# Altium project COMECA.PrjPcb
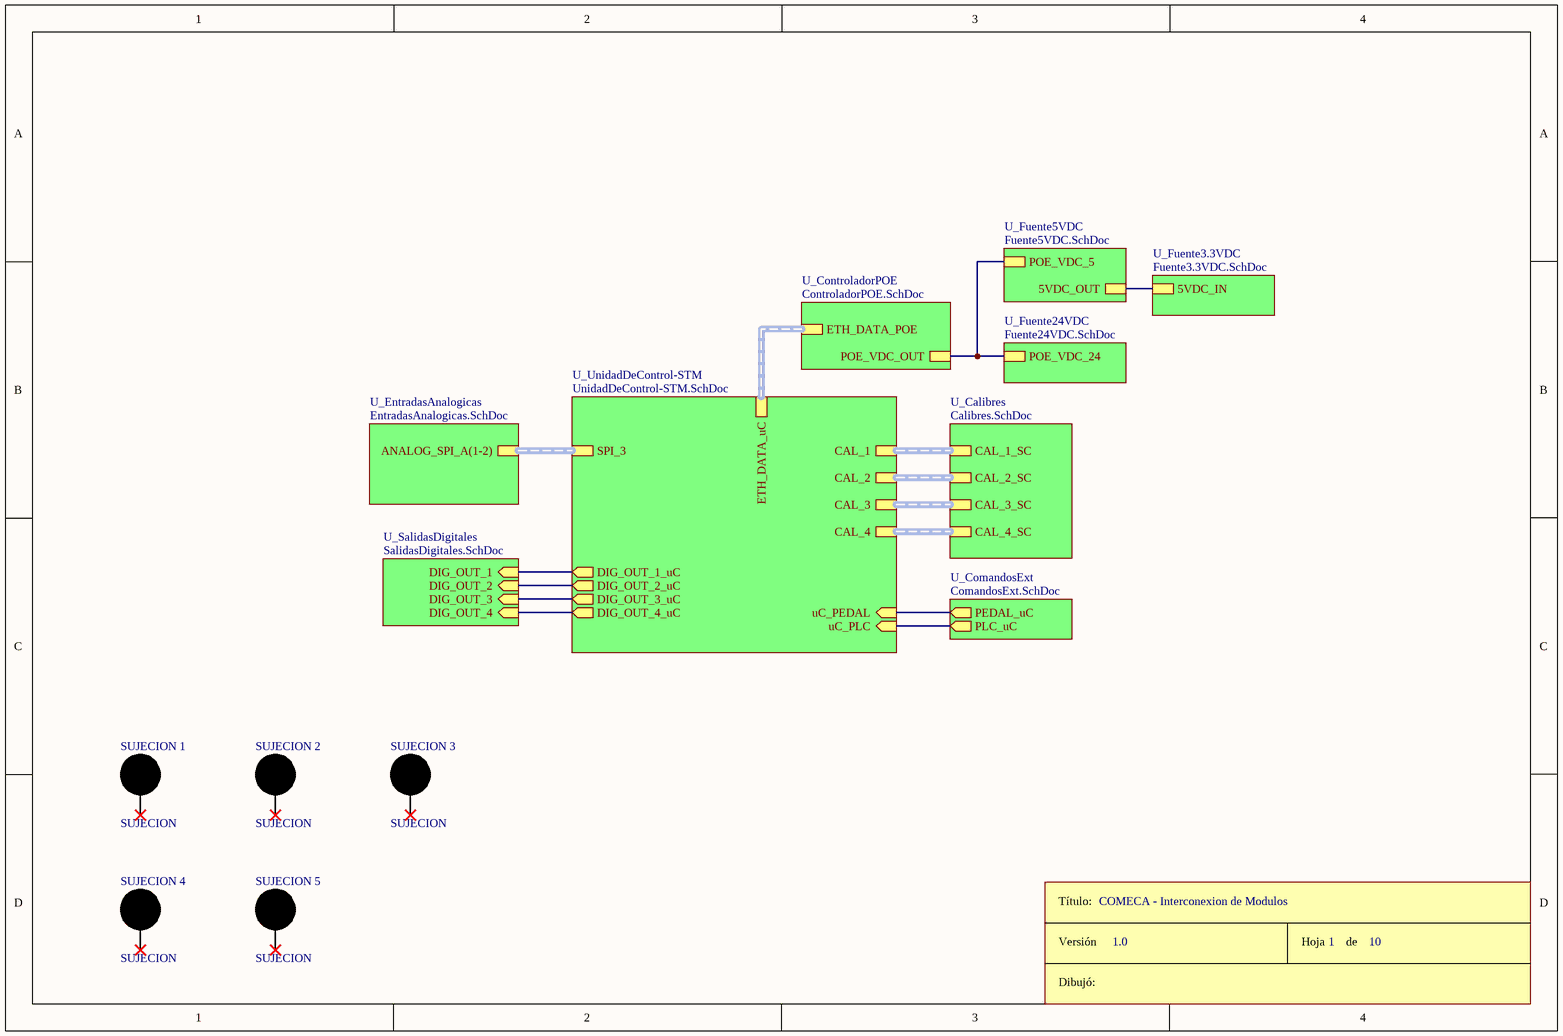
[diagram p0: COMECA_Main.SchDoc]
8 sheets, 88 parts. Net scope: hierarchical (ports join the sheet entries above them; power ports are global).
Board file: COMECA-PCBv1.PcbDoc
Sheets:
  COMECA_Main.SchDoc
    U_ControladorPOE = ControladorPOE.SchDoc
    U_Fuente5VDC = Fuente5VDC.SchDoc
    U_Fuente24VDC = Fuente24VDC.SchDoc
    U_Fuente3.3VDC = Fuente3.3VDC.SchDoc
    U_ComandosExt = ComandosExt.SchDoc
    U_EntradasAnalogicas = EntradasAnalogicas.SchDoc
    U_UnidadDeControl-STM = UnidadDeControl-STM.SchDoc

## Sheet COMECA_Main.SchDoc
size A4; SheetNumber: 1; SheetTotal: 10

### Parts
ROT9  Rótulo  (value not drawn)  (graphical)
SUJECION_1  SUJECION  [SUJECION (5.00MM - 3.50MM)]
SUJECION_2  SUJECION  [SUJECION (5.00MM - 3.50MM)]
SUJECION_3  SUJECION  [SUJECION (5.00MM - 3.50MM)]
SUJECION_4  SUJECION  [SUJECION (5.00MM - 3.50MM)]
SUJECION_5  SUJECION  [SUJECION (5.00MM - 3.50MM)]

### Sub-sheets
U_Calibres = Calibres.SchDoc (file not in this document): CAL_4_SC (harness CALIBRE), CAL_3_SC (harness CALIBRE), CAL_2_SC (harness CALIBRE), CAL_1_SC (harness CALIBRE)
U_ComandosExt = ComandosExt.SchDoc: PLC_uC (out), PEDAL_uC (out)
U_ControladorPOE = ControladorPOE.SchDoc: POE_VDC_OUT, ETH_DATA_POE (harness ETH_DATA)
U_EntradasAnalogicas = EntradasAnalogicas.SchDoc: ANALOG_SPI_A(1-2) (harness ANALOG_SPI)
U_Fuente3.3VDC = Fuente3.3VDC.SchDoc: 5VDC_IN
U_Fuente5VDC = Fuente5VDC.SchDoc: POE_VDC_5, 5VDC_OUT
U_Fuente24VDC = Fuente24VDC.SchDoc: POE_VDC_24
U_SalidasDigitales = SalidasDigitales.SchDoc (file not in this document): DIG_OUT_4 (in), DIG_OUT_2 (in), DIG_OUT_3 (in), DIG_OUT_1 (in)
U_UnidadDeControl-STM = UnidadDeControl-STM.SchDoc: uC_PLC (in), uC_PEDAL (in), SPI_3 (harness ANALOG_SPI), CAL_2 (harness CALIBRE), CAL_3 (harness CALIBRE), CAL_4 (harness CALIBRE), CAL_1 (harness CALIBRE), DIG_OUT_3_uC (out), DIG_OUT_2_uC (out), DIG_OUT_1_uC (out), DIG_OUT_4_uC (out), ETH_DATA_uC (harness ETH_DATA)

### Nets
PB6: sheet U_ComandosExt/PLC_uC, sheet U_UnidadDeControl-STM/uC_PLC
PB8: sheet U_ComandosExt/PEDAL_uC, sheet U_UnidadDeControl-STM/uC_PEDAL
PC7: sheet U_UnidadDeControl-STM/DIG_OUT_2_uC, sheet U_SalidasDigitales/DIG_OUT_2
PC9: sheet U_UnidadDeControl-STM/DIG_OUT_1_uC, sheet U_SalidasDigitales/DIG_OUT_1
PD13: sheet U_UnidadDeControl-STM/DIG_OUT_4_uC, sheet U_SalidasDigitales/DIG_OUT_4
PD15: sheet U_UnidadDeControl-STM/DIG_OUT_3_uC, sheet U_SalidasDigitales/DIG_OUT_3
NetC1_1: sheet U_ControladorPOE/POE_VDC_OUT, sheet U_Fuente5VDC/POE_VDC_5, sheet U_Fuente24VDC/POE_VDC_24
NetC3_1: sheet U_Fuente5VDC/5VDC_OUT, sheet U_Fuente3.3VDC/5VDC_IN

Not connected (* = marked no-connect by the designer): SUJECION_1 1*; SUJECION_2 1*; SUJECION_3 1*; SUJECION_4 1*; SUJECION_5 1*

### Buses and harness runs
harness sheet U_Calibres/CAL_1_SC = sheet U_UnidadDeControl-STM/CAL_1
harness sheet U_Calibres/CAL_2_SC = sheet U_UnidadDeControl-STM/CAL_2
harness sheet U_Calibres/CAL_3_SC = sheet U_UnidadDeControl-STM/CAL_3
harness sheet U_Calibres/CAL_4_SC = sheet U_UnidadDeControl-STM/CAL_4
harness sheet U_ControladorPOE/ETH_DATA_POE = sheet U_UnidadDeControl-STM/ETH_DATA_uC
harness sheet U_EntradasAnalogicas/ANALOG_SPI_A(1-2) = sheet U_UnidadDeControl-STM/SPI_3

### Notes on the sheet
- COMECA - Interconexion de Modulos
- 1.0
- 1
- 10
- (in symbol Rótulo) Título:; Versión; Hoja       de; Dibujó:

## Sheet ControladorPOE.SchDoc
size A4; SheetNumber: 8; SheetTotal: 10
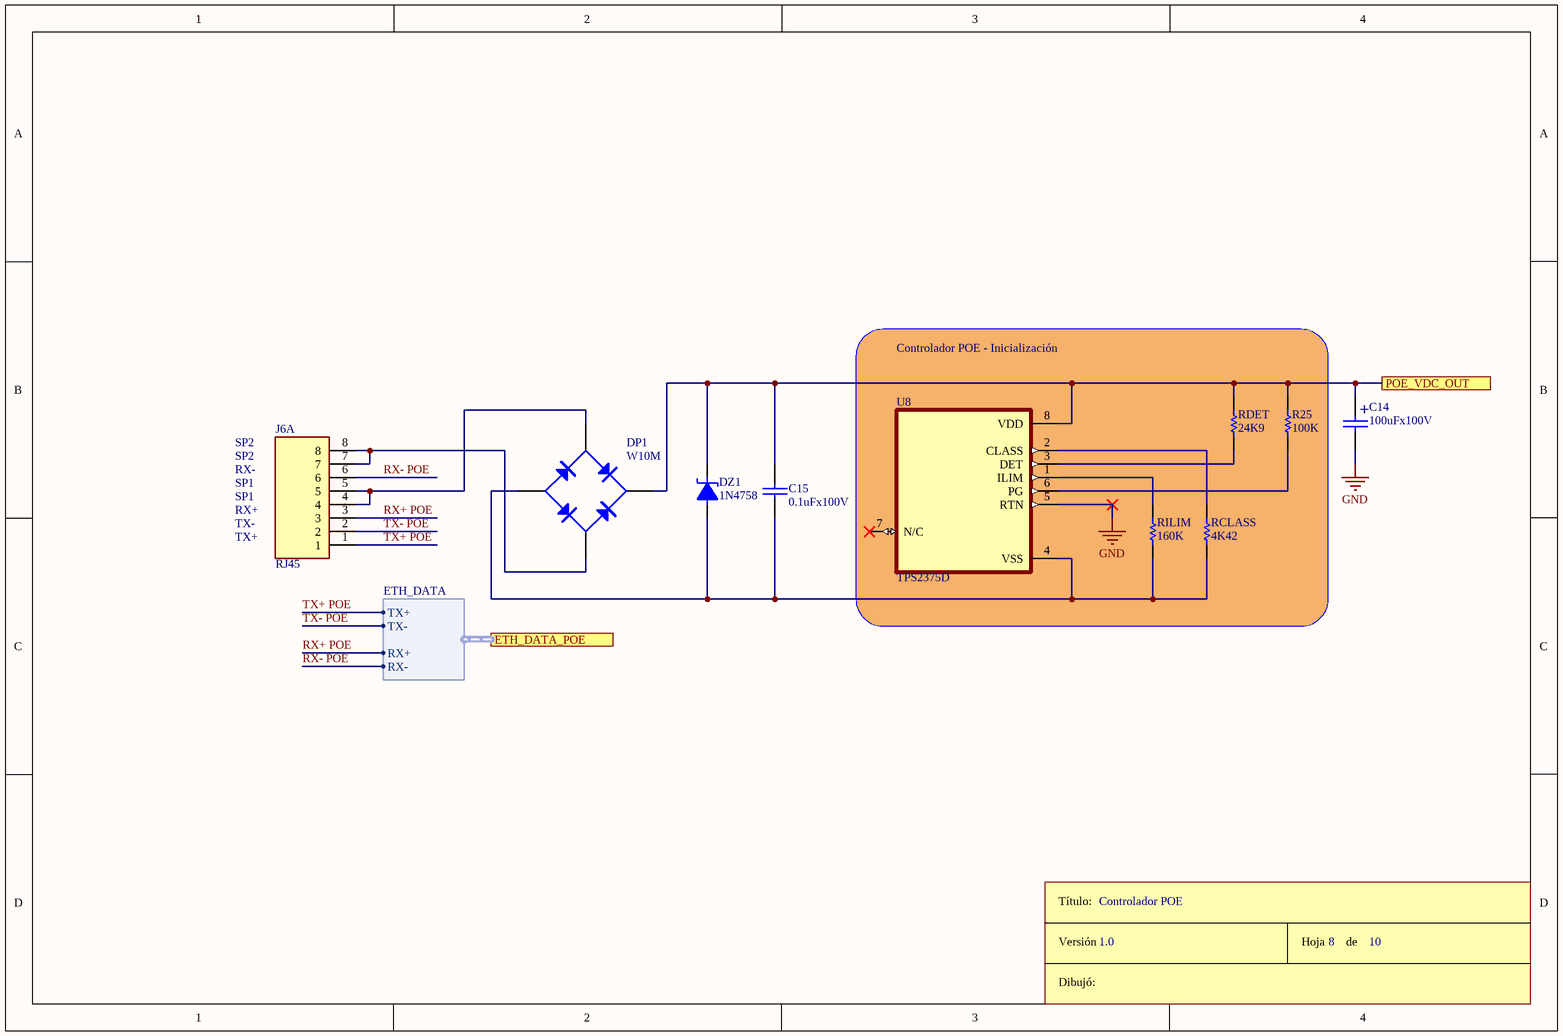
[diagram p1: ControladorPOE.SchDoc]

### Parts
C14  100uFx100V  [CAP200RP]
C15  0.1uFx100V  [CAP300]
DP1  W10M  [PUENTE - W10M]
DZ1  1N4758  [DO41]
J6A  RJ45  [CUI_CRJ032-1-TH]
R25  100K  [RES300]
RCLASS  4K42  [RES300]
RDET  24K9  [RES300]
RILIM  160K  [RES300]
ROT7  Rótulo  (value not drawn)  (graphical)
U8  TPS2375D  [SOIC127P599X175-8N]

### Blocks framed on the sheet
Controlador POE - Inicialización: R25 RCLASS RDET RILIM U8

### Ports
ETH_DATA_POE (harness ETH_DATA), POE_VDC_OUT

### Harnesses
ETH_DATA: TX+, TX-, RX+, RX-

### Nets
GND: C14.2 U8.5(RTN)
RX+ POE: J6A.3 ; port ETH_DATA_POE.RX+
RX- POE: J6A.6 ; port ETH_DATA_POE.RX-
TX+ POE: J6A.1 ; port ETH_DATA_POE.TX+
TX- POE: J6A.2 ; port ETH_DATA_POE.TX-
NetC1_1: C14.1 C15.1 DP1.1(V+) DZ1.2 R25.2 RDET.2 U8.8(VDD) ; port POE_VDC_OUT
NetC15_2: C15.2 DP1.3(V-) DZ1.1 RCLASS.1 RILIM.1 U8.4(VSS)
NetDP1_2: DP1.2(AC) J6A.4 J6A.5
NetDP1_4: DP1.4(AC) J6A.7 J6A.8
NetR25_1: R25.1 U8.6(PG)
NetRCLASS_2: RCLASS.2 U8.2(CLASS)
NetRDET_1: RDET.1 U8.3(DET)
NetRILIM_2: RILIM.2 U8.1(ILIM)

Not connected (* = marked no-connect by the designer): U8 7(N/C)*

### Notes on the sheet
- SP2
- RX+
- RX-
- SP1
- TX+
- TX-
- Controlador POE
- 1.0
- 8
- 10
- (in symbol CAPPOL) +
- (in symbol Rótulo) Título:; Versión; Hoja       de; Dibujó:

### Library data of the parts
C14 = CAPPOL
C15 = CAP
DP1 = PUENTE
DZ1 = DIODO ZENER
J6A = CRJ032-1-TH: 8P8C, Single Port, Horizontal, Unshielded, No LED, Through Hole, RJ45 Modular Connector; MF: CUI Devices; MP: CRJ032-1-TH; SnapEDA_Link: https://www.snapeda.com/parts/CRJ032-1-TH/CUI%20Devices/view-part/6363031/?ref=snap; Availability: In Stock; CUI_purchase_URL: https://www.cuidevices.com/product/interconnect/connectors/modular-connectors/rj45-connectors/crj032-1-th?utm_source=snapeda.com&utm_medium=referral&utm_campaign=snapedaBOM; Check_prices: https://www.snapeda.com/parts/CRJ032-1-TH/CUI%20Devices/view-part/6363031/?ref=eda; Value: *; Purchase-URL: https://pricing.snapeda.com/search/part/CRJ032-1-TH/?ref=eda; Package: None; Price: None
R25 RCLASS RDET RILIM = RES
U8 = TPS2375D: Class 3 PoE PD with latch protection 8-SOIC -40 to 85; MF: Texas Instruments; Purchase-URL: https://pricing.snapeda.com/search/part/TPS2375D/?ref=eda; MP: TPS2375D; Package: SOIC-8 Texas Instruments; SnapEDA_Link: https://www.snapeda.com/parts/TPS2375D/Texas%20Instruments/view-part/570877/?ref=snap; Value: *; Check_prices: https://www.snapeda.com/parts/TPS2375D/Texas%20Instruments/view-part/570877/?ref=eda; Digi-Key_Part_Number: 296-26922-2-ND

## Sheet Fuente5VDC.SchDoc
size A4; SheetNumber: 3; SheetTotal: 10
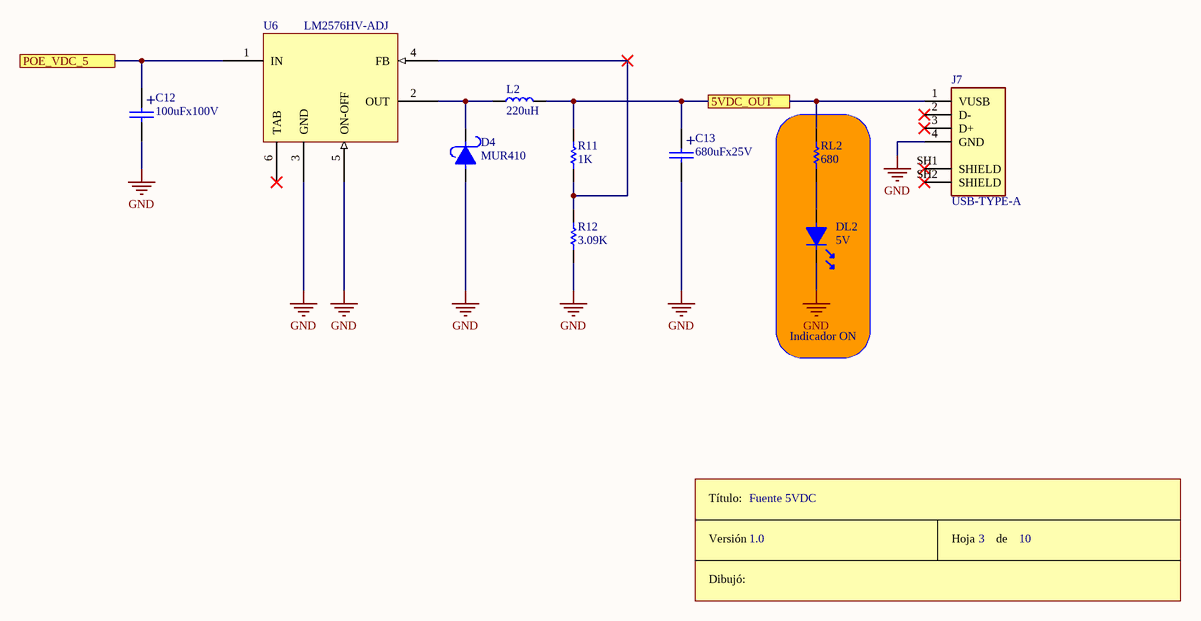
[diagram p2: Fuente5VDC.SchDoc]

### Parts
C12  100uFx100V  [CAP200RP]
C13  680uFx25V  [CAP200RP]
D4  MUR410  [DO41]
DL2  5V  [LED3]
J7  USB-TYPE-A  [TE_6364372-2]
L2  220uH  [CHOKE_PAD]
R11  1K  [RES300]
R12  3.09K  [RES300]
RL2  680  [RES300]
ROT5  Rótulo  (value not drawn)  (graphical)
U6  LM2576HV-ADJ  [TO-220_5 H]

### Blocks framed on the sheet
Indicador ON: DL2 RL2

### Ports
5VDC_OUT, POE_VDC_5

### Nets
GND: C12.2 C13.2 D4.1 DL2.2 J7.4(GND) R12.1 U6.3(GND) U6.5(ON-OFF)
NetC1_1: C12.1 U6.1(IN) ; port POE_VDC_5
NetC3_1: C13.1 J7.1(VUSB) L2.2 R11.2 RL2.2 ; port 5VDC_OUT
NetD4_2: D4.2 L2.1 U6.2(OUT)
NetDL2_1: DL2.1 RL2.1
NetR11_1: R11.1 R12.2 U6.4(FB)

Not connected (* = marked no-connect by the designer): J7 2(D-)* 3(D+)* SH1(SHIELD)* SH2(SHIELD)*; U6 6(TAB)*

### Notes on the sheet
- Fuente 5VDC
- 1.0
- 3
- 10
- (in symbol CAPPOL) +
- (in symbol Rótulo) Título:; Versión; Hoja       de; Dibujó:

### Library data of the parts
C12 C13 = CAPPOL
D4 = DIODO SCHOTTKY
DL2 = LED
J7 = 6364372-2: Conn USB 2.0 Type A RCP 4 POS Solder RA Thru-Hole 4 Terminal 1 Port Box/Tube; MF: TE Connectivity; Digi-Key_Purchase_URL: https://www.digikey.com/product-detail/en/te-connectivity-amp-connectors/6364372-2/A122647-ND/2286712?utm_source=snapeda&utm_medium=aggregator&utm_campaign=symbol; SnapEDA_Link: https://www.snapeda.com/parts/6364372-2/TE%20Connectivity%20AMP%20Connectors/view-part/2053020/?ref=snap; EU_RoHS_Compliance: Compliant; MP: 6364372-2; Value: *; TE_purchase_URL: https://www.te.com/usa-en/product-6364372-2.html?te_bu=Cor&te_type=disp&te_campaign=seda_glo_cor-seda-global-disp-prtnr-fy19-seda-model-bom-cta_sma-317_1&elqCampaignId=32493; Digi-Key_Part_Number: A122647-ND; Package: None
L2 = Choke
R11 R12 RL2 = RES
U6 = LM2575

## Sheet Fuente24VDC.SchDoc
size A4; SheetNumber: 2; SheetTotal: 10
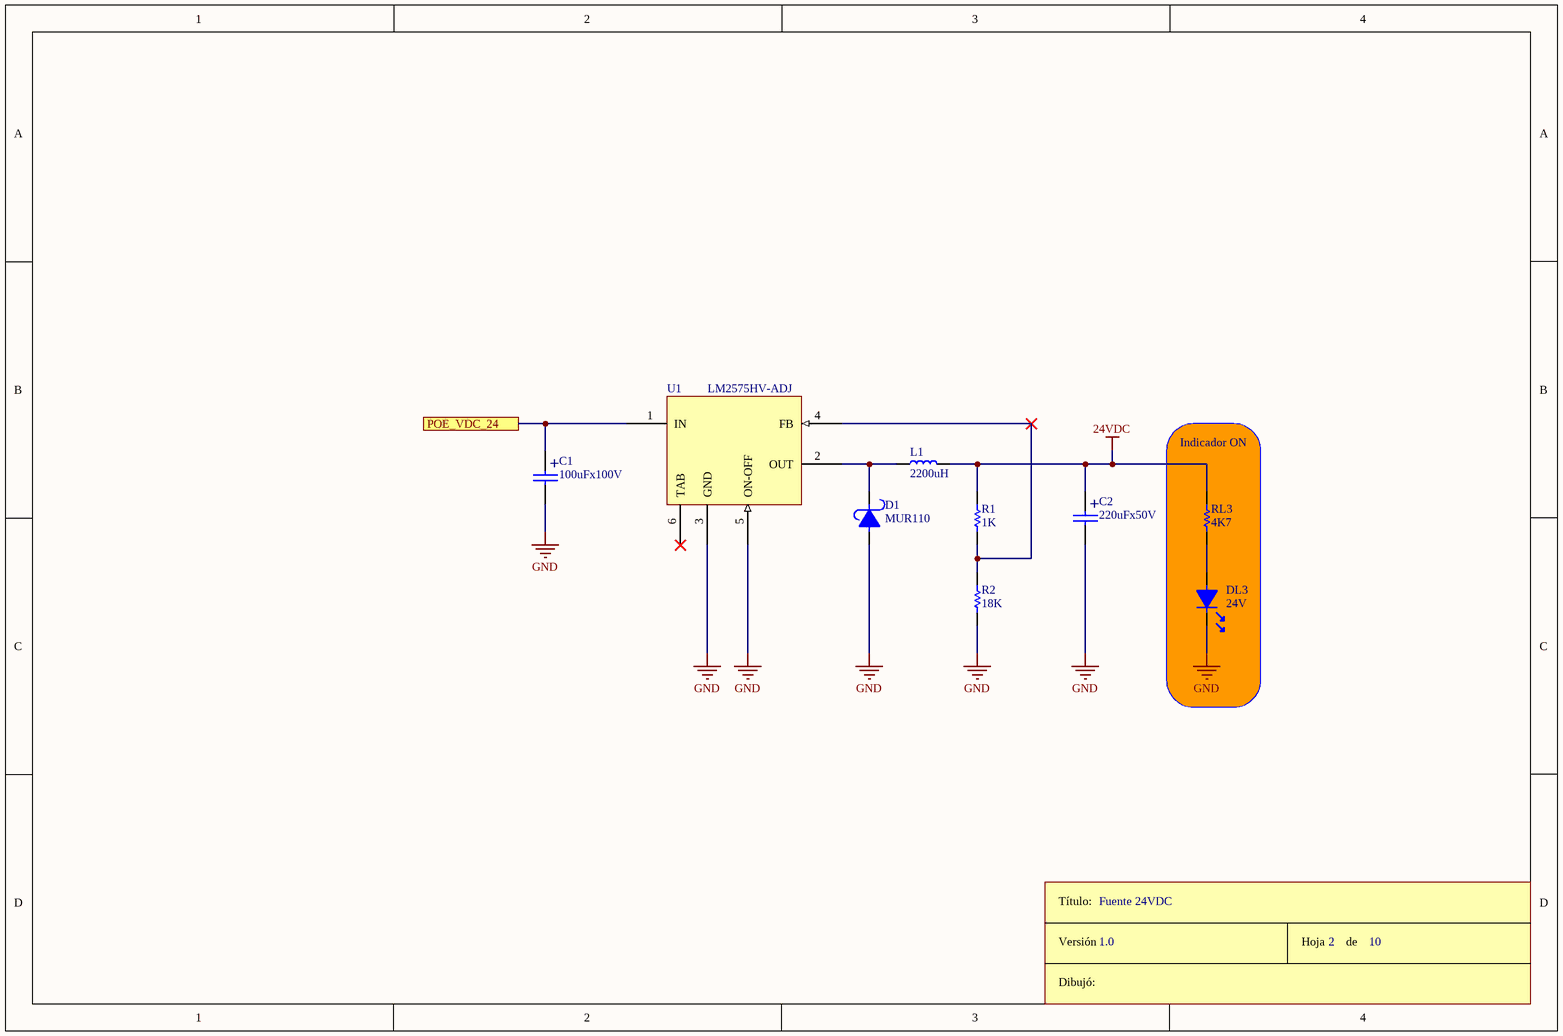
[diagram p3: Fuente24VDC.SchDoc]

### Parts
C1  100uFx100V  [CAP200RP]
C2  220uFx50V  [CAP200RP]
D1  MUR110  [DO41]
DL3  24V  [LED3]
L1  2200uH  [Choke10.5]
R1  1K  [RES300]
R2  18K  [RES300]
RL3  4K7  [RES300]
ROT1  Rótulo  (value not drawn)  (graphical)
U1  LM2575HV-ADJ  [TO-220_5 H]

### Blocks framed on the sheet
Indicador ON: DL3 RL3

### Ports
POE_VDC_24

### Nets
24VDC: C2.1 L1.2 R1.2 RL3.2
GND: C1.2 C2.2 D1.1 DL3.2 R2.1 U1.3(GND) U1.5(ON-OFF)
NetC1_1: C1.1 U1.1(IN) ; port POE_VDC_24
NetD1_2: D1.2 L1.1 U1.2(OUT)
NetDL3_1: DL3.1 RL3.1
NetR1_1: R1.1 R2.2 U1.4(FB)

Not connected (* = marked no-connect by the designer): U1 6(TAB)*

### Notes on the sheet
- Fuente 24VDC
- 1.0
- 2
- 10
- (in symbol CAPPOL) +
- (in symbol Rótulo) Título:; Versión; Hoja       de; Dibujó:

### Library data of the parts
C1 C2 = CAPPOL
D1 = DIODO SCHOTTKY
DL3 = LED
L1 = Choke
R1 R2 RL3 = RES
U1 = LM2575

## Sheet Fuente3.3VDC.SchDoc
size A4; SheetNumber: 4; SheetTotal: 10
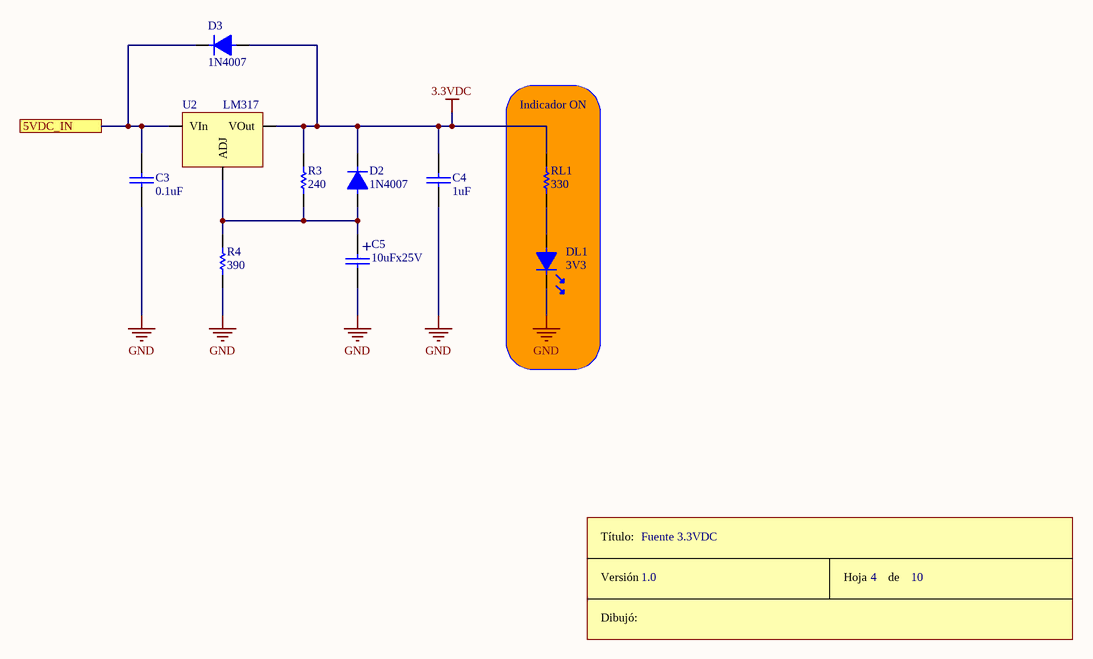
[diagram p4: Fuente3.3VDC.SchDoc]

### Parts
C3  0.1uF  [CAP100]
C4  1uF  [CAP200]
C5  10uFx25V  [CAP100RP]
D2  1N4007  [DO41]
D3  1N4007  [DO41]
DL1  3V3  [LED3]
R3  240  [RES400]
R4  390  [RES400]
RL1  330  [RES300]
ROT2  Rótulo  (value not drawn)  (graphical)
U2  LM317  [TO-220 H]

### Blocks framed on the sheet
Indicador ON: DL1 RL1

### Ports
5VDC_IN

### Nets
3.3VDC: C4.1 D2.2 D3.1 R3.2 RL1.2 U2.2(VOut)
GND: C3.2 C4.2 C5.2 DL1.2 R4.1
NetC3_1: C3.1 D3.2 U2.3(VIn) ; port 5VDC_IN
NetC5_1: C5.1 D2.1 R3.1 R4.2 U2.1(ADJ)
NetDL1_1: DL1.1 RL1.1

### Notes on the sheet
- Fuente 3.3VDC
- 1.0
- 4
- 10
- (in symbol CAPPOL) +
- (in symbol Rótulo) Título:; Versión; Hoja       de; Dibujó:

### Library data of the parts
C3 C4 = CAP
C5 = CAPPOL
D2 D3 = DIODO
DL1 = LED
R3 R4 RL1 = RES
U2 = LM317: IC REG ADJ 1.5A 3 TERM TO-220

## Sheet ComandosExt.SchDoc
size A4; SheetNumber: 5; SheetTotal: 10
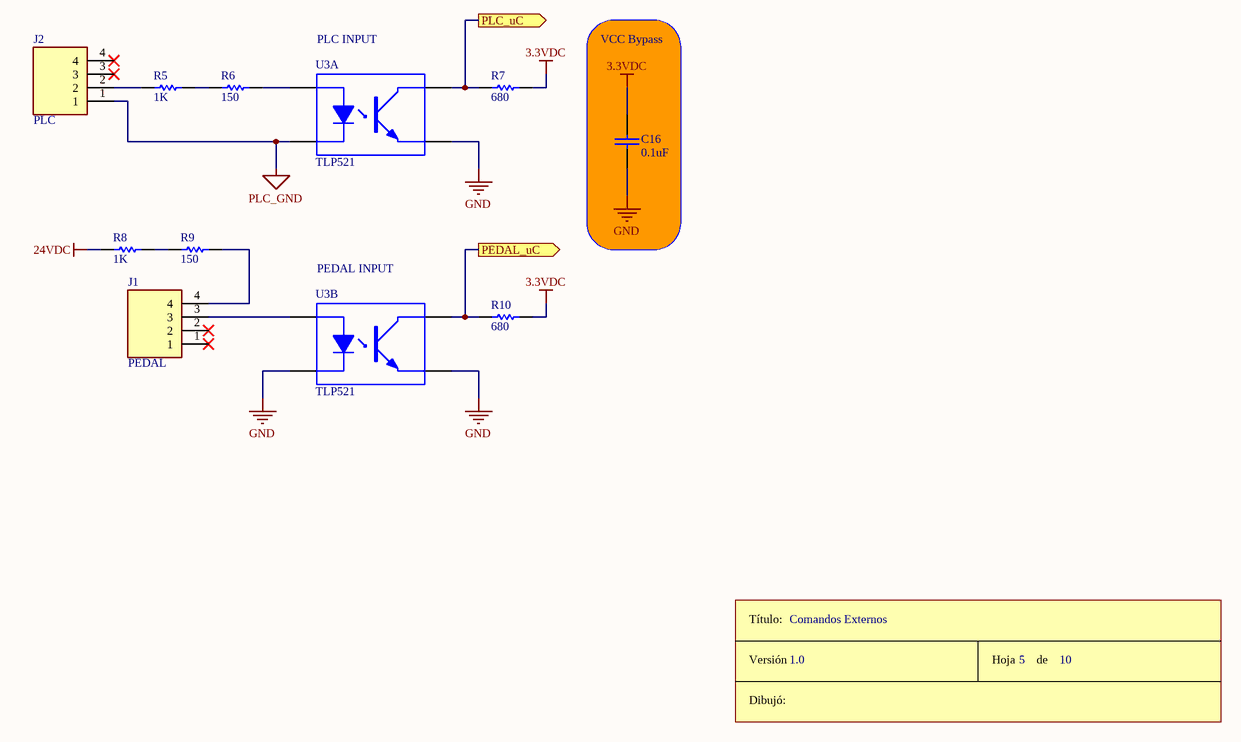
[diagram p5: ComandosExt.SchDoc]

### Parts
C16  0.1uF  [CAP100]
J1  PEDAL  [TE_1586863-4]
J2  PLC  [TE_1586863-4]
R5  1K  [RES300]
R6  150  [RES300]
R7  680  [RES300]
R8  1K  [RES300]
R9  150  [RES300]
R10  680  [RES300]
ROT3  Rótulo  (value not drawn)  (graphical)
U3  TLP521  [DIP8]  (parts A,B of 2)

### Blocks framed on the sheet
VCC Bypass: C16

### Ports
PEDAL_uC (out), PLC_uC (out)

### Nets
3.3VDC: C16.1 R7.2 R10.2
24VDC: R8.1
GND: C16.2 U3.4(K) U3.5(E) U3.7(E)
PLC_GND: J2.1 U3.2(K)
PB6: R7.1 U3.8(C) ; port PLC_uC
PB8: R10.1 U3.6(C) ; port PEDAL_uC
NetJ1_3: J1.3 U3.3(A)
NetJ1_4: J1.4 R9.2
NetJ2_2: J2.2 R5.1
NetR5_2: R5.2 R6.1
NetR6_2: R6.2 U3.1(A)
NetR8_2: R8.2 R9.1

Not connected (* = marked no-connect by the designer): J1 1* 2*; J2 3* 4*

### Notes on the sheet
- (near U3) PLC INPUT
- (near U3) PEDAL INPUT
- Comandos Externos
- 1.0
- 5
- 10
- (in symbol Rótulo) Título:; Versión; Hoja       de; Dibujó:

### Library data of the parts
C16 = CAP
J1 J2 = 1586863-4: Conn Power HDR 4 POS 4.2mm Solder RA Thru-Hole 4 Terminal 1 Port Tray; MF: TE Connectivity; Price: None; Value: *; TE_purchase_URL: https://www.te.com/usa-en/product-1586863-4.html?te_bu=Cor&te_type=disp&te_campaign=seda_glo_cor-seda-global-disp-prtnr-fy19-seda-model-bom-cta_sma-317_1&elqCampaignId=32493; SnapEDA_Link: https://www.snapeda.com/parts/1586863-4/TE%20Connectivity%20AMP%20Connectors/view-part/1401879/?ref=snap; Package: None; EU_RoHS_Compliance: Compliant; Availability: Unavailable; MP: 1586863-4
R5-R10 = RES
U3 = TLP521-2: PhotoCoupler

## Sheet EntradasAnalogicas.SchDoc
size A4; SheetNumber: 6; SheetTotal: 10
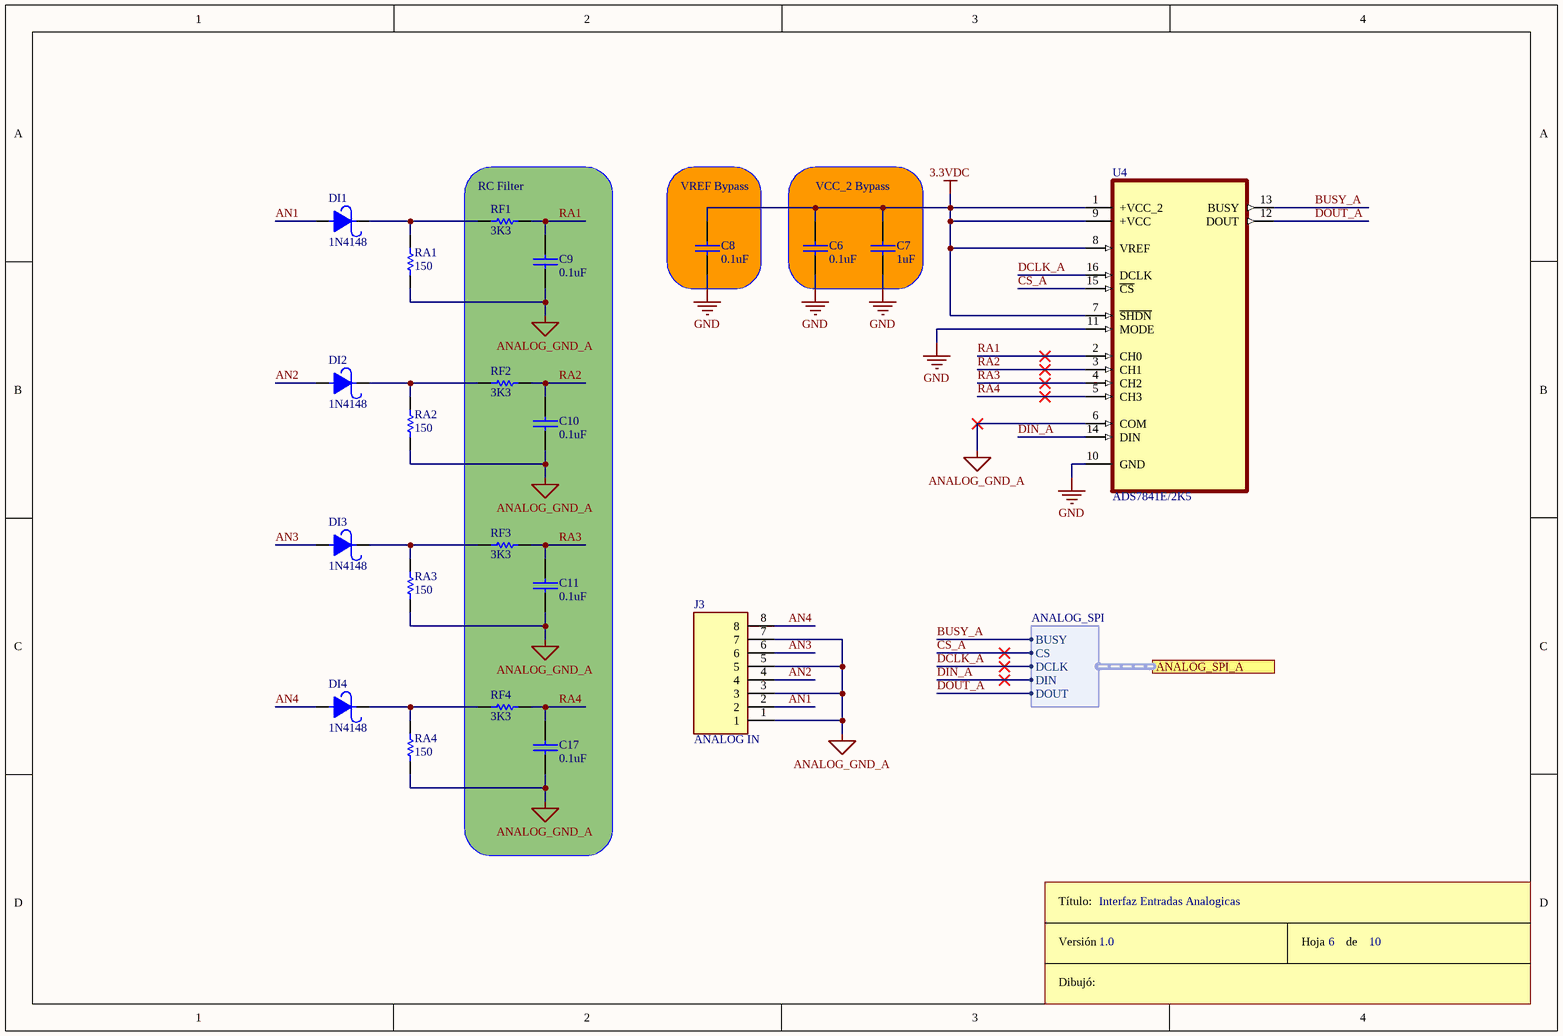
[diagram p6: EntradasAnalogicas.SchDoc]

### Parts
C6  0.1uF  [CAP100]
C7  1uF  [CAP200]
C8  0.1uF  [CAP100]
C9  0.1uF  [CAP100]
C10  0.1uF  [CAP100]
C11  0.1uF  [CAP100]
C17  0.1uF  [CAP100]
DI1  1N4148  [DO41]
DI2  1N4148  [DO41]
DI3  1N4148  [DO41]
DI4  1N4148  [DO41]
J3  ANALOG IN  [TE_1586863-8]
RA1  150  [RES300]
RA2  150  [RES300]
RA3  150  [RES300]
RA4  150  [RES300]
RF1  3K3  [RES300]
RF2  3K3  [RES300]
RF3  3K3  [RES300]
RF4  3K3  [RES300]
ROT4  Rótulo  (value not drawn)  (graphical)
U4  ADS7841E/2K5  [SOP63P600X175-16N]

### Blocks framed on the sheet
RC Filter: C9-C11 C17 RF1-RF4
VREF Bypass: C8
VCC_2 Bypass: C6 C7

### Ports
ANALOG_SPI_A (harness ANALOG_SPI)

### Harnesses
ANALOG_SPI: BUSY, CS, DCLK, DIN, DOUT

### Nets
3.3VDC: C6.1 C7.1 C8.1 U4.1(+VCC_2) U4.7(~{SHDN}) U4.8(VREF) U4.9(+VCC)
ANALOG_GND_A: C9.2 C10.2 C11.2 C17.2 J3.1 J3.3 J3.5 J3.7 RA1.1 RA2.1 RA3.1 RA4.1 U4.6(COM)
GND: C6.2 C7.2 C8.2 U4.10(GND) U4.11(MODE)
AN1: DI1.1 J3.2
AN2: DI2.1 J3.4
AN3: DI3.1 J3.6
AN4: DI4.1 J3.8
BUSY_A: U4.13(BUSY) ; port ANALOG_SPI_A.BUSY
CS_A: U4.15(~{CS}) ; port ANALOG_SPI_A.CS
DCLK_A: U4.16(DCLK) ; port ANALOG_SPI_A.DCLK
DIN_A: U4.14(DIN) ; port ANALOG_SPI_A.DIN
DOUT_A: U4.12(DOUT) ; port ANALOG_SPI_A.DOUT
RA1: C9.1 RF1.2 U4.2(CH0)
RA2: C10.1 RF2.2 U4.3(CH1)
RA3: C11.1 RF3.2 U4.4(CH2)
RA4: C17.1 RF4.2 U4.5(CH3)
NetDI1_2: DI1.2 RA1.2 RF1.1
NetDI2_2: DI2.2 RA2.2 RF2.1
NetDI3_2: DI3.2 RA3.2 RF3.1
NetDI4_2: DI4.2 RA4.2 RF4.1

### Notes on the sheet
- Interfaz Entradas Analogicas
- 1.0
- 6
- 10
- (in symbol Rótulo) Título:; Versión; Hoja       de; Dibujó:

### Library data of the parts
C6-C11 C17 = CAP
DI1-DI4 = DIODO SCHOTTKY
J3 = 1586863-8: Conn Power HDR 8 POS 4.2mm Solder RA Thru-Hole 8 Terminal 1 Port Tray; MF: TE Connectivity; EU_RoHS_Compliance: Compliant; SnapEDA_Link: https://www.snapeda.com/parts/1586863-8/TE%20Connectivity%20AMP%20Connectors/view-part/1404500/?ref=snap; Price: None; Package: None; Availability: Unavailable; MP: 1586863-8; TE_purchase_URL: https://www.te.com/usa-en/product-1586863-8.html?te_bu=Cor&te_type=disp&te_campaign=seda_glo_cor-seda-global-disp-prtnr-fy19-seda-model-bom-cta_sma-317_1&elqCampaignId=32493; Value: *
RA1-RA4 RF1-RF4 = RES
U4 = ADS7841E/2K5: ANALOG-TO-DIGITAL CONVERTER; Package: None; Price: None; Value: *; MP: ADS7841E/2K5; Availability: Unavailable

## Sheet UnidadDeControl-STM.SchDoc
size A4; SheetNumber: 9; SheetTotal: 10
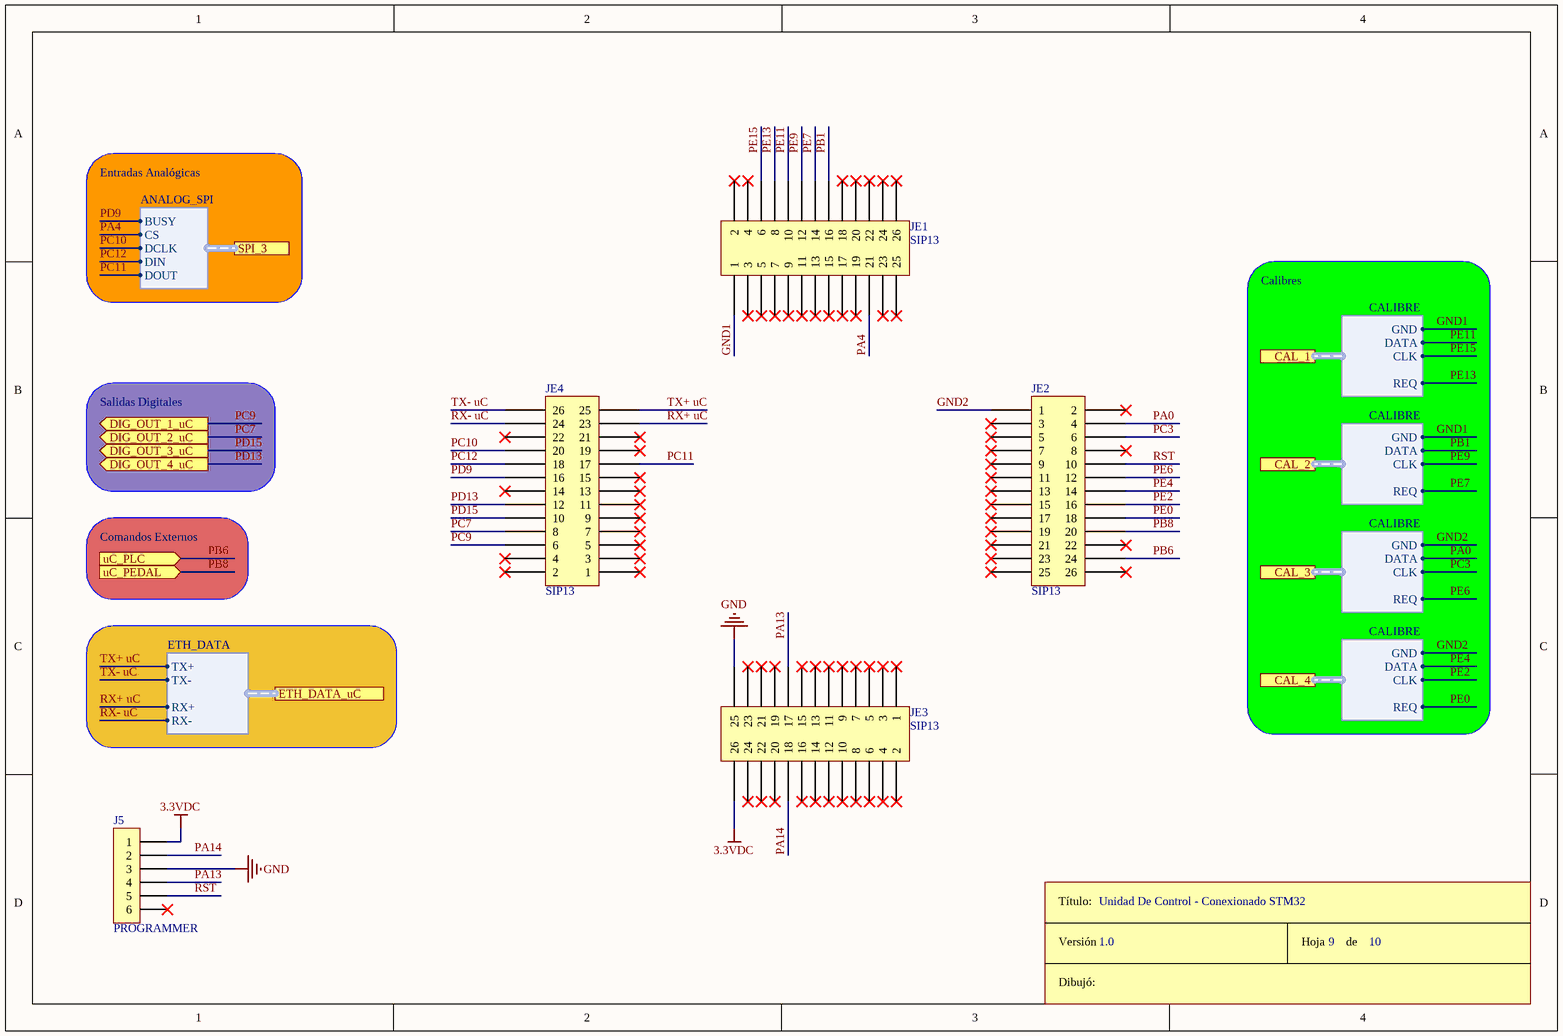
[diagram p7: UnidadDeControl-STM.SchDoc]

### Parts
J5  PROGRAMMER  [SIP6]
JE1  SIP13  [SIP13*2 - HDR]
JE2  SIP13  [SIP13*2 - HDR]
JE3  SIP13  [SIP13*2 - HDR]
JE4  SIP13  [SIP13*2 - HDR]
ROT8  Rótulo  (value not drawn)  (graphical)

### Ports
CAL_1 (harness CALIBRE), CAL_2 (harness CALIBRE), CAL_3 (harness CALIBRE), CAL_4 (harness CALIBRE), DIG_OUT_1_uC (out), DIG_OUT_2_uC (out), DIG_OUT_3_uC (out), DIG_OUT_4_uC (out), ETH_DATA_uC (harness ETH_DATA), SPI_3 (harness ANALOG_SPI), uC_PEDAL (in), uC_PLC (in)

### Harnesses
ANALOG_SPI: BUSY, CS, DCLK, DIN, DOUT
CALIBRE: CLK, DATA, GND, REQ
ETH_DATA: RX+, RX-, TX+, TX-

### Nets
3.3VDC: J5.1 JE3.26
GND: J5.3 JE3.25
GND1: JE1.1 ; port CAL_1.GND, port CAL_2.GND
GND2: JE2.1 ; port CAL_3.GND, port CAL_4.GND
PA0: JE2.4 ; port CAL_3.DATA
PA4: JE1.21 ; port SPI_3.CS
PA13: J5.4 JE3.17
PA14: J5.2 JE3.18
PB1: JE1.16 ; port CAL_2.DATA
PB6: JE2.24 ; port uC_PLC
PB8: JE2.20 ; port uC_PEDAL
PC3: JE2.6 ; port CAL_3.CLK
PC7: JE4.8 ; port DIG_OUT_2_uC
PC9: JE4.6 ; port DIG_OUT_1_uC
PC10: JE4.20 ; port SPI_3.DCLK
PC11: JE4.17 ; port SPI_3.DOUT
PC12: JE4.18 ; port SPI_3.DIN
PD9: JE4.16 ; port SPI_3.BUSY
PD13: JE4.12 ; port DIG_OUT_4_uC
PD15: JE4.10 ; port DIG_OUT_3_uC
PE0: JE2.18 ; port CAL_4.REQ
PE2: JE2.16 ; port CAL_4.CLK
PE4: JE2.14 ; port CAL_4.DATA
PE6: JE2.12 ; port CAL_3.REQ
PE7: JE1.14 ; port CAL_2.REQ
PE9: JE1.12 ; port CAL_2.CLK
PE11: JE1.10 ; port CAL_1.DATA
PE13: JE1.8 ; port CAL_1.REQ
PE15: JE1.6 ; port CAL_1.CLK
RST: J5.5 JE2.10
RX+ uC: JE4.23 ; port ETH_DATA_uC.RX+  [project net RX+ POE]
RX- uC: JE4.24 ; port ETH_DATA_uC.RX-  [project net RX- POE]
TX+ uC: JE4.25 ; port ETH_DATA_uC.TX+  [project net TX+ POE]
TX- uC: JE4.26 ; port ETH_DATA_uC.TX-  [project net TX- POE]

Not connected (* = marked no-connect by the designer): J5 6*; JE1 2* 3* 4* 5* 7* 9* 11* 13* 15* 17* 18* 19* 20* 22* 23* 24* 25* 26*; JE2 2* 3* 5* 7* 8* 9* 11* 13* 15* 17* 19* 21* 22* 23* 25* 26*; JE3 1* 2* 3* 4* 5* 6* 7* 8* 9* 10* 11* 12* 13* 14* 15* 16* 19* 20* 21* 22* 23* 24*; JE4 1* 2* 3* 4* 5* 7* 9* 11* 13* 14* 15* 19* 21* 22*

### Notes on the sheet
- Entradas Analógicas
- Calibres
- Salidas Digitales
- Comandos Externos
- Unidad De Control - Conexionado STM32
- 1.0
- 9
- 10
- (in symbol Rótulo) Título:; Versión; Hoja       de; Dibujó:

### Library data of the parts
J5 = CON6
JE1-JE4 = CON13*2

## Nets that join several sheets
3.3VDC: Fuente3.3VDC (6 pins), ComandosExt (C16.1 R7.2 R10.2), EntradasAnalogicas (7 pins), UnidadDeControl-STM (J5.1 JE3.26)
24VDC: Fuente24VDC (C2.1 L1.2 R1.2 RL3.2), ComandosExt (R8.1)
GND: ControladorPOE (C14.2 U8.5), Fuente5VDC (8 pins), Fuente24VDC (7 pins), Fuente3.3VDC (5 pins), ComandosExt (C16.2 U3.4 U3.5 U3.7), EntradasAnalogicas (5 pins), UnidadDeControl-STM (J5.3 JE3.25)
NetC1_1: ControladorPOE (7 pins), Fuente5VDC (C12.1 U6.1), Fuente24VDC (C1.1 U1.1)
NetC3_1: Fuente5VDC (5 pins), Fuente3.3VDC (C3.1 D3.2 U2.3)
PB6: ComandosExt (R7.1 U3.8), UnidadDeControl-STM (JE2.24)
PB8: ComandosExt (R10.1 U3.6), UnidadDeControl-STM (JE2.20)
RX+ POE: ControladorPOE (J6A.3), UnidadDeControl-STM (JE4.23)
RX- POE: ControladorPOE (J6A.6), UnidadDeControl-STM (JE4.24)
TX+ POE: ControladorPOE (J6A.1), UnidadDeControl-STM (JE4.25)
TX- POE: ControladorPOE (J6A.2), UnidadDeControl-STM (JE4.26)